# Altium schematic sheet Half_Slave.SchDoc
size C
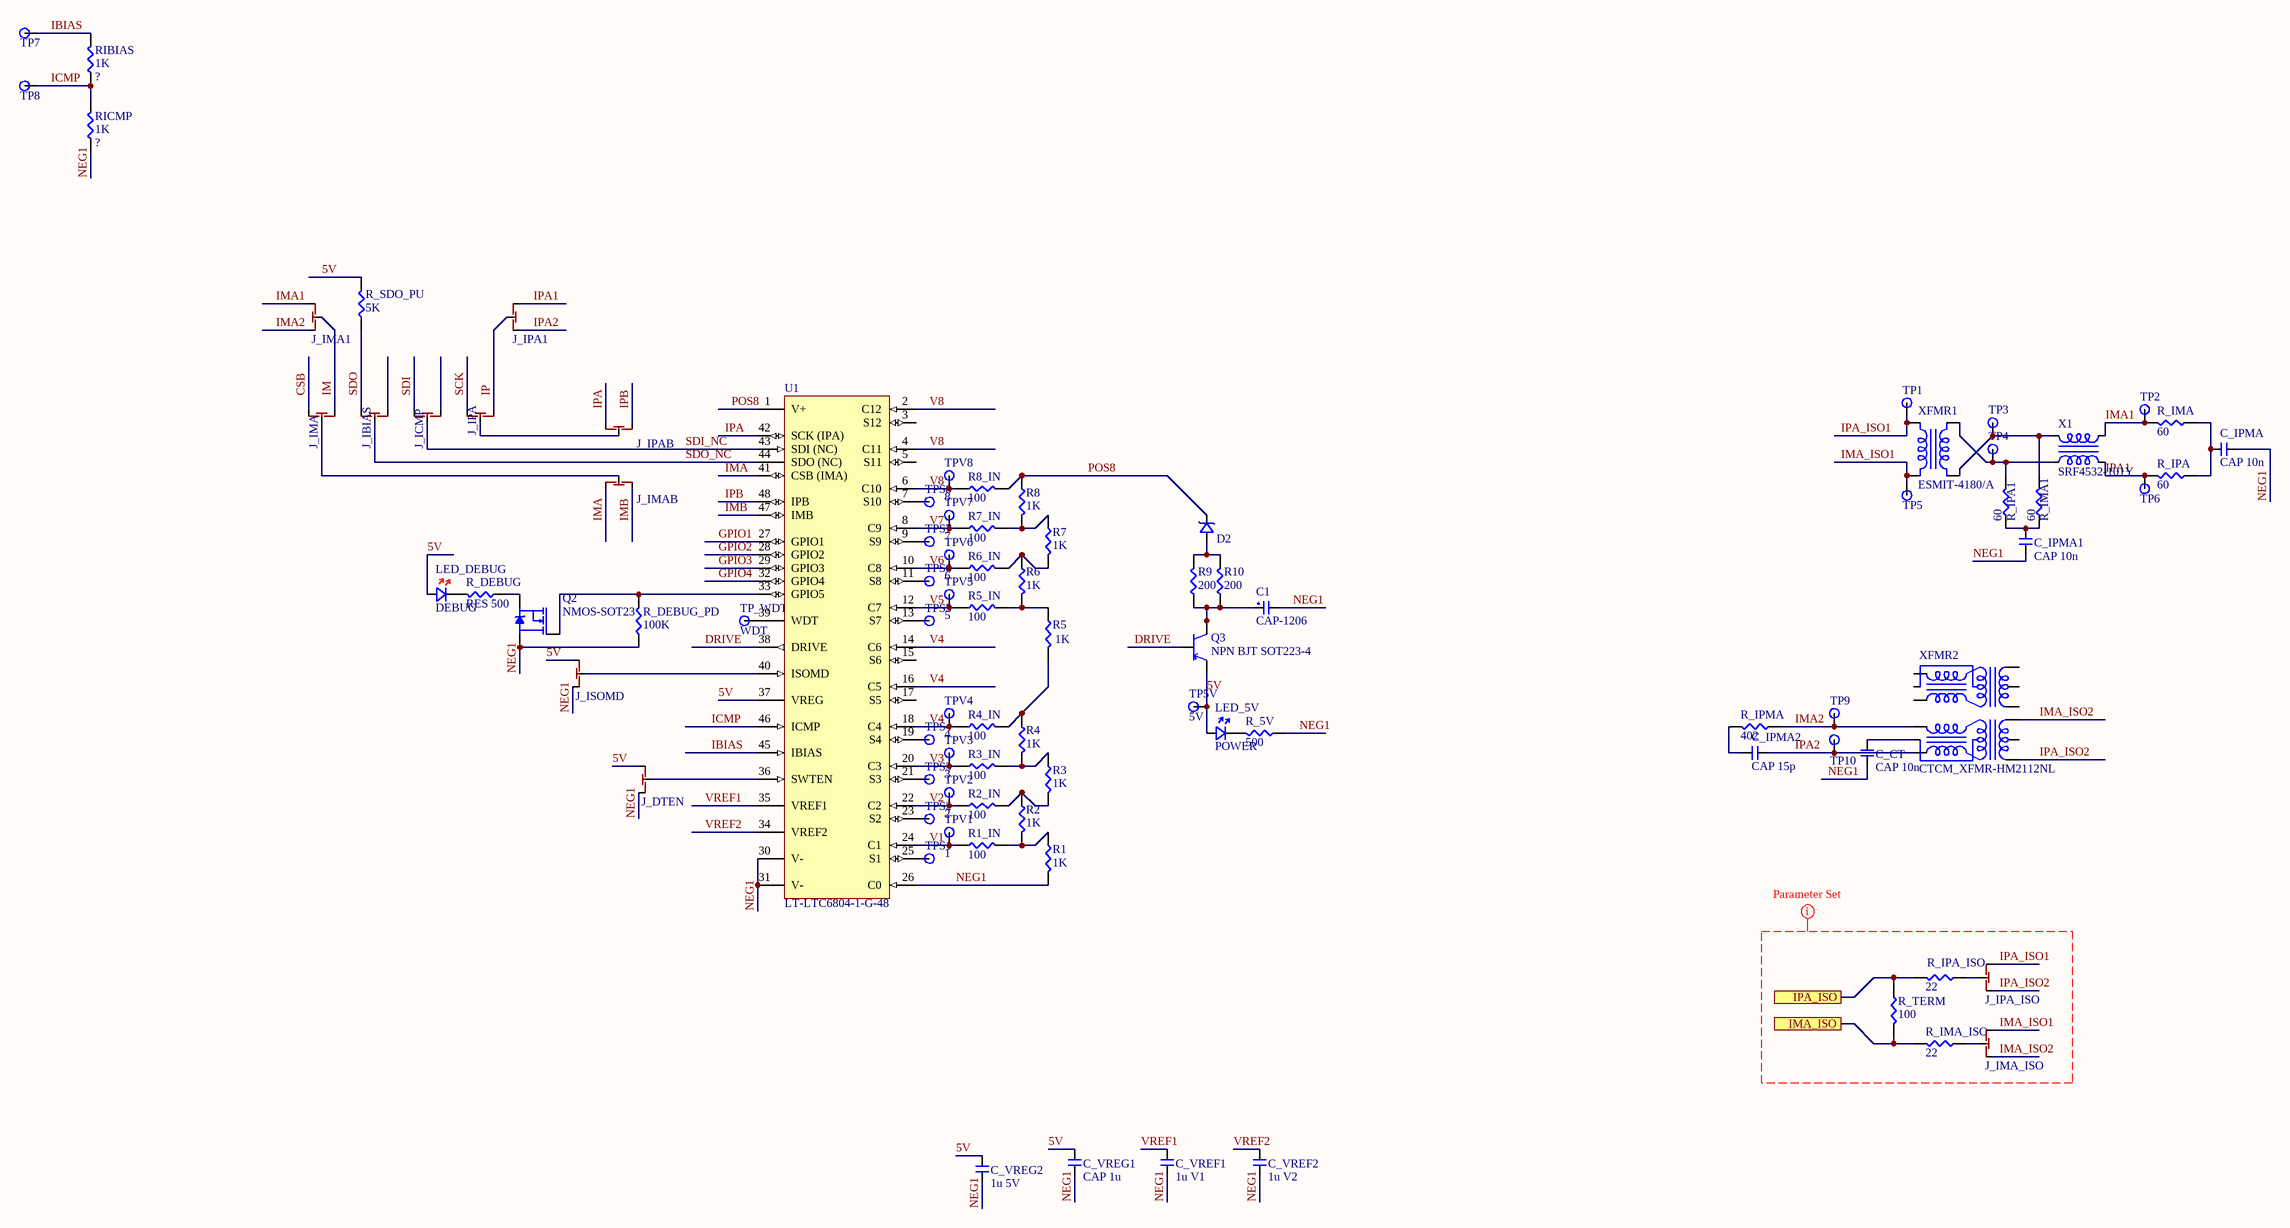
[diagram p0: Half_Slave.SchDoc]

## Parts
C1  CAP-1206  [CAPCP3216X16N]
C_CT  CAP 10n  [CAP-0603]
C_IPMA  CAP 10n  [CAP-0603]
C_IPMA1  CAP 10n  [CAP-0603]
C_IPMA2  CAP 15p  [CAP-0603]
C_VREF1  1u V1  [CAP-0603]
C_VREF2  1u V2  [CAP-0603]
C_VREG1  CAP 1u  [CAP-0603]
C_VREG2  1u 5V  [CAP-0603]
D2  ?  [SMB]  (value not drawn)
J_DTEN  DPDT Solder Jumper  [DPDT Solder]  (value not drawn)
J_IBIAS  DPDT Solder Jumper  [DPDT Solder]  (value not drawn)
J_ICMP  DPDT Solder Jumper  [DPDT Solder]  (value not drawn)
J_IMA  DPDT Solder Jumper  [DPDT Solder]  (value not drawn)
J_IMA1  DPDT Solder Jumper  [DPDT Solder]  (value not drawn)
J_IMA_ISO  DPDT Solder Jumper  [DPDT Solder]  (value not drawn)
J_IMAB  DPDT Solder Jumper  [DPDT Solder]  (value not drawn)
J_IPA  DPDT Solder Jumper  [DPDT Solder]  (value not drawn)
J_IPA1  DPDT Solder Jumper  [DPDT Solder]  (value not drawn)
J_IPA_ISO  DPDT Solder Jumper  [DPDT Solder]  (value not drawn)
J_IPAB  DPDT Solder Jumper  [DPDT Solder]  (value not drawn)
J_ISOMD  DPDT Solder Jumper  [DPDT Solder]  (value not drawn)
LED_5V  POWER  [LEDBLUE-0603]
LED_DEBUG  DEBUG  [LEDRED-0603]
Q2  NMOS-SOT23  [SOT23]
Q3  NPN BJT SOT223-4  [SOT223]
R1  1K  [RES-0603]
R1_IN  100  [RES-0603]
R2  1K  [RES-0603]
R2_IN  100  [RES-0603]
R3  1K  [RES-0603]
R3_IN  100  [RES-0603]
R4  1K  [RES-0603]
R4_IN  100  [RES-0603]
R5  1K  [RES-0603]
R5_IN  100  [RES-0603]
R6  1K  [RES-0603]
R6_IN  100  [RES-0603]
R7  1K  [RES-0603]
R7_IN  100  [RES-0603]
R8  1K  [RES-0603]
R8_IN  100  [RES-0603]
R9  200  [RES-0603]
R10  200  [RES-0603]
R_5V  500  [RES-0603]
R_DEBUG  RES 500  [RES-0603]
R_DEBUG_PD  100K  [RES-0603]
R_IMA  60  [RES-0603]
R_IMA1  60  [RES-0603]
R_IMA_ISO  22  [RES-0603]
R_IPA  60  [RES-0603]
R_IPA1  60  [RES-0603]
R_IPA_ISO  22  [RES-0603]
R_IPMA  402  [RES-0603]
R_SDO_PU  5K  [RES-0603]
R_TERM  100  [RES-0603]
RIBIAS  1K  [RES-0603]
RICMP  1K  [RES-0603]
TP1  IP_ISO  [Testpoint]  (value not drawn)
TP2  IMA  [Testpoint]  (value not drawn)
TP3  IM_F  [Testpoint]  (value not drawn)
TP4  IP_F  [Testpoint]  (value not drawn)
TP5  IM_ISO  [Testpoint]  (value not drawn)
TP5V  5V  [Testpoint]
TP6  IPA  [Testpoint]  (value not drawn)
TP7  IBIAS  [Testpoint]  (value not drawn)
TP8  ICMP  [Testpoint]  (value not drawn)
TP9  IMA  [Testpoint]  (value not drawn)
TP10  IPA  [Testpoint]  (value not drawn)
TP_WDT  WDT  [Testpoint]
TPS1  (no value)  [Testpoint]
TPS2  (no value)  [Testpoint]
TPS3  (no value)  [Testpoint]
TPS4  (no value)  [Testpoint]
TPS5  (no value)  [Testpoint]
TPS6  (no value)  [Testpoint]
TPS7  (no value)  [Testpoint]
TPS8  (no value)  [Testpoint]
TPV1  1  [Testpoint]
TPV2  2  [Testpoint]
TPV3  3  [Testpoint]
TPV4  4  [Testpoint]
TPV5  5  [Testpoint]
TPV6  6  [Testpoint]
TPV7  7  [Testpoint]
TPV8  8  [Testpoint]
U1  LT-LTC6804-1-G-48  [SSOP-48N]
X1  SRF4532-101Y  [SRF4532]
XFMR1  ESMIT-4180/A  [ISOXFMR_ESMIT4180]
XFMR2  CTCM_XFMR-HM2112NL  [HM2112NL]

## Ports
IMA_ISO, IPA_ISO

## Nets
5V: C_VREG1.2 C_VREG2.2 J_DTEN.2 J_ISOMD.2 LED_5V.A LED_DEBUG.A Q3.3(E) R_SDO_PU.2 TP5V.1 U1.37(VREG)
CSB: J_IMA.1
DRIVE: Q3.1(B) U1.38(DRIVE)
GPIO1: U1.27(GPIO1)
GPIO2: U1.28(GPIO2)
GPIO3: U1.29(GPIO3)
GPIO4: U1.32(GPIO4)
IBIAS: RIBIAS.2 TP7.1 U1.45(IBIAS)
ICMP: RIBIAS.1 RICMP.2 TP8.1 U1.46(ICMP)
IM: J_IMA.2 J_IMA1.3
IMA: J_IMAB.2 U1.41(CSB_(IMA))
IMA1: J_IMA1.2 R_IMA.2 TP2.1 X1.1
IMA2: J_IMA1.1 R_IPMA.1 TP9.1 XFMR2.9
IMA_ISO: R_IMA_ISO.2 R_TERM.2 ; port IMA_ISO
IMA_ISO1: J_IMA_ISO.2 TP5.1 XFMR1.1
IMA_ISO2: J_IMA_ISO.1 XFMR2.4
IMB: J_IMAB.1 U1.47(IMB)
IP: J_IPA.2 J_IPA1.3
IPA: J_IPAB.2 U1.42(SCK_(IPA))
IPA1: J_IPA1.2 R_IPA.2 TP6.1 X1.4
IPA2: C_IPMA2.1 J_IPA1.1 TP10.1 XFMR2.7
IPA_ISO: R_IPA_ISO.2 R_TERM.1 ; port IPA_ISO
IPA_ISO1: J_IPA_ISO.2 TP1.1 XFMR1.2
IPA_ISO2: J_IPA_ISO.1 XFMR2.6
IPB: J_IPAB.1 U1.48(IPB)
NEG1: C1.2 C_CT.2 C_IPMA.1 C_IPMA1.1 C_VREF1.1 C_VREF2.1 C_VREG1.1 C_VREG2.1 J_DTEN.1 J_ISOMD.1 Q2.2(S) R1.2 R_5V.1 R_DEBUG_PD.1 RICMP.1 U1.26(C0) U1.30(V-) U1.31(V-)
POS8: D2.K R8.1 R8_IN.2 U1.1(V+)
SCK: J_IPA.1
SDI: J_ICMP.1
SDI_NC: J_ICMP.3 U1.43(SDI_(NC))
SDO: J_IBIAS.1 R_SDO_PU.1
SDO_NC: J_IBIAS.3 U1.44(SDO_(NC))
V1: R1_IN.1 TPV1.1 U1.24(C1)
V2: R2_IN.1 TPV2.1 U1.22(C2)
V3: R3_IN.1 TPV3.1 U1.20(C3)
V4: R4_IN.1 TPV4.1 U1.14(C6) U1.16(C5) U1.18(C4)
V5: R5_IN.1 TPV5.1 U1.12(C7)
V6: R6_IN.1 TPV6.1 U1.10(C8)
V7: R7_IN.1 TPV7.1 U1.8(C9)
V8: R8_IN.1 TPV8.1 U1.2(C12) U1.4(C11) U1.6(C10)
VREF1: C_VREF1.2 U1.35(VREF1)
VREF2: C_VREF2.2 U1.34(VREF2)
NetC1_1: C1.1 Q3.2(C) Q3.4(C) R9.1 R10.1
NetC_CT_1: C_CT.1 XFMR2.8
NetC_IPMA1_2: C_IPMA1.2 R_IMA1.1 R_IPA1.1
NetC_IPMA2_2: C_IPMA2.2 R_IPMA.2
NetC_IPMA_2: C_IPMA.2 R_IMA.1 R_IPA.1
NetD2_A: D2.A R9.2 R10.2
NetJ_DTEN_3: J_DTEN.3 U1.36(SWTEN)
NetJ_IMA_3: J_IMA.3 J_IMAB.3
NetJ_IMA_ISO_3: J_IMA_ISO.3 R_IMA_ISO.1
NetJ_IPA_3: J_IPA.3 J_IPAB.3
NetJ_IPA_ISO_3: J_IPA_ISO.3 R_IPA_ISO.1
NetJ_ISOMD_3: J_ISOMD.3 U1.40(ISOMD)
NetLED_5V_K: LED_5V.K R_5V.2
NetLED_DEBUG_K: LED_DEBUG.K R_DEBUG.2
NetQ2_1: Q2.1(G) R_DEBUG_PD.2 U1.33(GPIO5)
NetQ2_3: Q2.3(D) R_DEBUG.1
NetR1_1: R1.1 R1_IN.2 R2.2
NetR2_1: R2.1 R2_IN.2 R3.2
NetR3_1: R3.1 R3_IN.2 R4.2
NetR4_1: R4.1 R4_IN.2 R5.2
NetR5_1: R5.1 R5_IN.2 R6.2
NetR6_1: R6.1 R6_IN.2 R7.2
NetR7_1: R7.1 R7_IN.2 R8.2
NetR_IMA1_2: R_IMA1.2 TP3.1 X1.2 XFMR1.4
NetR_IPA1_2: R_IPA1.2 TP4.1 X1.3 XFMR1.3
NetTP_WDT_1: TP_WDT.1 U1.39(WDT)
NetTPS1_1: TPS1.1 U1.25(S1)
NetTPS2_1: TPS2.1 U1.23(S2)
NetTPS3_1: TPS3.1 U1.21(S3)
NetTPS4_1: TPS4.1 U1.19(S4)
NetTPS5_1: TPS5.1 U1.13(S7)
NetTPS6_1: TPS6.1 U1.11(S8)
NetTPS7_1: TPS7.1 U1.9(S9)
NetTPS8_1: TPS8.1 U1.7(S10)

Not connected (* = marked no-connect by the designer): J_IBIAS 2; J_ICMP 2; U1 3(S12) 5(S11) 15(S6) 17(S5); XFMR2 1 2 3 5 10 11 12

## Layout directives
rule Clearance Constraint [Clearance = 32mil]; net class ISO: IMA_ISO1, IMA_ISO2, IPA_ISO1, IPA_ISO2

## Library data of the parts
C_CT C_IPMA C_IPMA1 C_IPMA2 C_VREF1 C_VREF2 C_VREG1 C_VREG2 = CAP-0603
D2 = DIODE-SMB
J_DTEN J_IBIAS J_ICMP J_IMA J_IMA1 J_IMA_ISO J_IMAB J_IPA J_IPA1 J_IPA_ISO J_IPAB J_ISOMD = DPDT Solder
LED_5V = LEDBLUE-0603
LED_DEBUG = LEDRED-0603
Q3 = NPN_SOT223-4: BCP54,115
R1 R1_IN R2 R2_IN R3 R3_IN R4 R4_IN R5 R5_IN R6 R6_IN R7 R7_IN R8 R8_IN R9 R10 R_5V R_DEBUG R_DEBUG_PD R_IMA R_IMA1 R_IMA_ISO R_IPA R_IPA1 R_IPA_ISO R_IPMA R_SDO_PU R_TERM = RES-0603
RIBIAS RICMP = RES_0603: RES SMD 0603; Company: IFE; Part: RES_0603; Value: ?; Package: 0603
TP1-TP5 TP5V TP6-TP10 TP_WDT TPS1-TPS8 TPV1-TPV8 = Testpoint
X1 = CMC_SRF4532
XFMR1 = ISOXFMR_ESMIT4180